# Altium schematic sheet STM32L0_USB_TempSensor.SchDoc: Block Diagram
size A4; SheetNumber: 1; SheetTotal: 3; SheetSize: A4
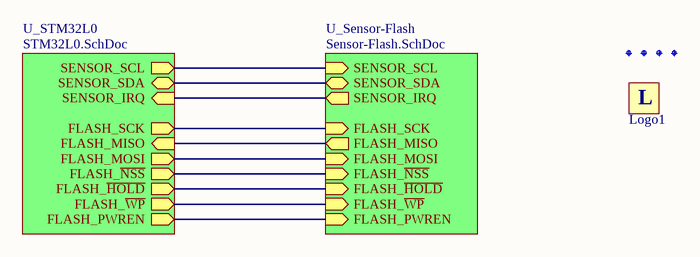
[diagram p0: STM32L0_USB_TempSensor.SchDoc]

## Parts
Fid1  Fiducial mark  [Fiducial]  (value not drawn)  (no BOM)
Fid2  Fiducial mark  [Fiducial]  (value not drawn)  (no BOM)
Fid3  Fiducial mark  [Fiducial]  (value not drawn)  (no BOM)
Fid4  Fiducial mark  [Fiducial]  (value not drawn)  (no BOM)
Logo1  Logo symbol  [LOGO_YILDIZIOT]  (value not drawn)  (no BOM)

## Sub-sheets
U_Sensor-Flash = Sensor-Flash.SchDoc: FLASH_~{NSS} (in), FLASH_SCK (in), FLASH_MISO (out), FLASH_MOSI (in), FLASH_~{HOLD} (in), FLASH_~{WP} (in), SENSOR_SCL (in), SENSOR_SDA (bidir), SENSOR_IRQ (out), FLASH_PWREN (in)
U_STM32L0 = STM32L0.SchDoc: SENSOR_SCL (out), SENSOR_SDA (bidir), FLASH_~{NSS} (out), FLASH_SCK (out), FLASH_MISO (in), FLASH_MOSI (out), FLASH_~{HOLD} (out), FLASH_~{WP} (out), SENSOR_IRQ (in), FLASH_PWREN (out)

## Nets
(unnamed): sheet U_STM32L0/SENSOR_SCL, sheet U_Sensor-Flash/SENSOR_SCL
(unnamed): sheet U_STM32L0/SENSOR_SDA, sheet U_Sensor-Flash/SENSOR_SDA
(unnamed): sheet U_STM32L0/FLASH_~{NSS}, sheet U_Sensor-Flash/FLASH_~{NSS}
(unnamed): sheet U_STM32L0/FLASH_SCK, sheet U_Sensor-Flash/FLASH_SCK
(unnamed): sheet U_STM32L0/FLASH_MISO, sheet U_Sensor-Flash/FLASH_MISO
(unnamed): sheet U_STM32L0/FLASH_MOSI, sheet U_Sensor-Flash/FLASH_MOSI
(unnamed): sheet U_STM32L0/FLASH_~{HOLD}, sheet U_Sensor-Flash/FLASH_~{HOLD}
(unnamed): sheet U_STM32L0/FLASH_~{WP}, sheet U_Sensor-Flash/FLASH_~{WP}
(unnamed): sheet U_STM32L0/SENSOR_IRQ, sheet U_Sensor-Flash/SENSOR_IRQ
(unnamed): sheet U_STM32L0/FLASH_PWREN, sheet U_Sensor-Flash/FLASH_PWREN

## Notes on the sheet
- Title:
- Size:
- Project:
- Revision:
- Sheet
- of
- Date:
- YıLDıZ IoT
- Elperek Mahallesi
- Saray Sokak, No:12
- SAKARYA / TURKEY
- File:
- (in symbol Logo) L

## Library data of the parts
Fid1-Fid4 = Fiducial: Part Number: Fid-Mark; Artikkelnr Noca: N.A.; Manufacturer: *; Manufacturer Part Number: *; Datasheet: *; LatestRevisionDate: 2009-12-12; Pin Count: 1; Publisher: Nordic Semiconductor; Published: 2009-12-12; Value: *; Note: *; Supplier: *; Supplier part number: *; 2nd source Supplier: *; 2nd source part number: *; Footprint Doc: Fiducial; Artikkelnr Simpro: N.A.
Logo1 = Logo: Schematic symbol for Logo